# Altium schematic sheet GUI.SchDoc
size A
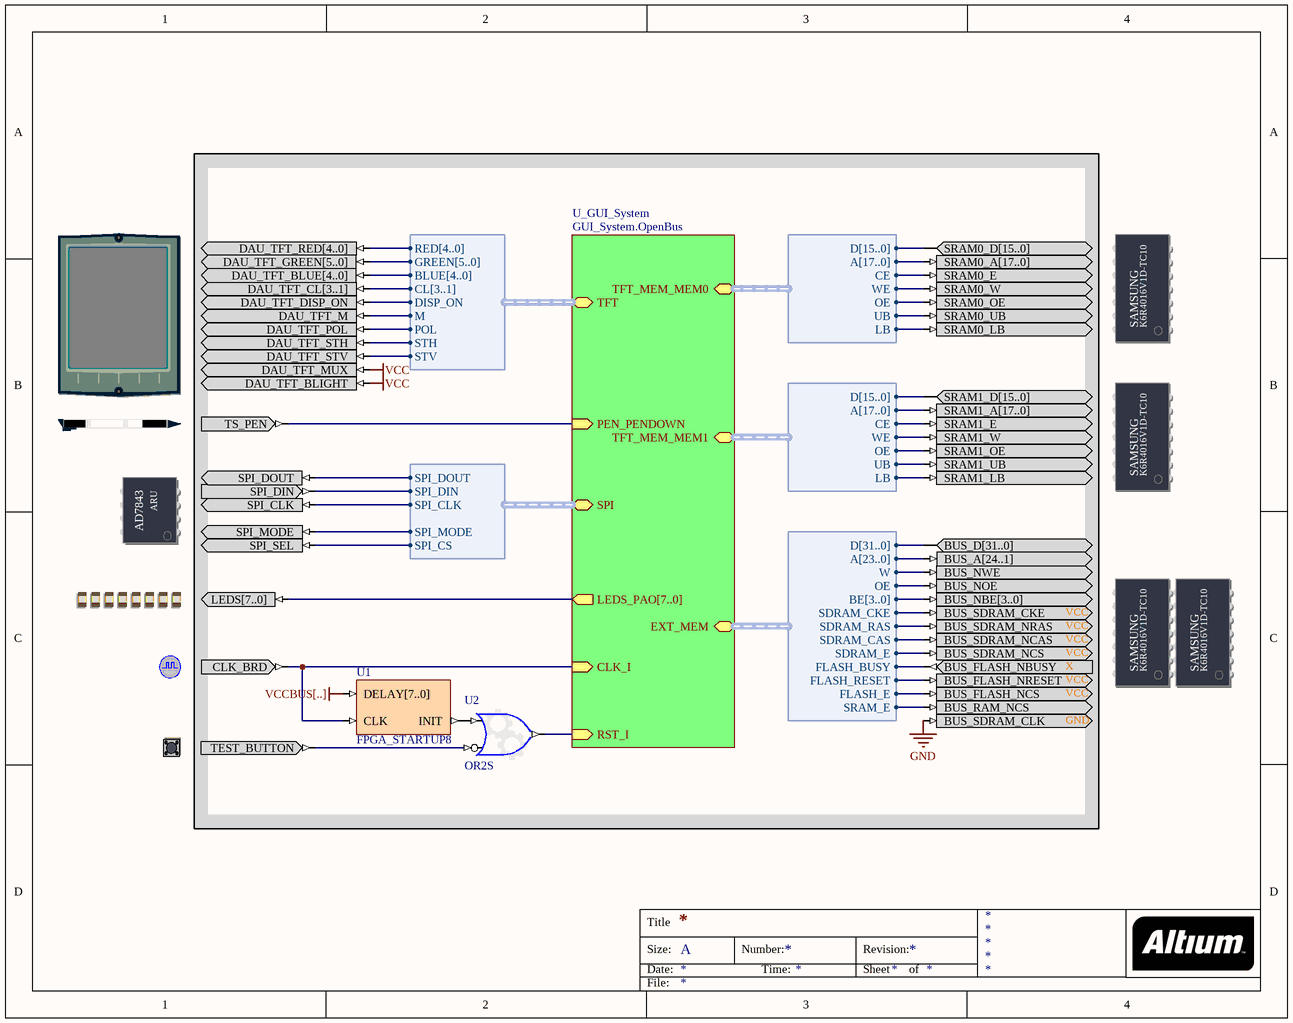
[diagram p0: GUI.SchDoc]

## Parts
(Parts that share a designator on the sheet are numbered #1, #2 ... from top to bottom, then left to right.)
?#1  TFT_LCD  (value not drawn)
?#2  SRAM_DAUGHTER0  (value not drawn)
?#3  SRAM_DAUGHTER1  (value not drawn)
?#4  TOUCHSCREEN_PEN_DOWN  (value not drawn)
?#5  TOUCH_SCREEN_DIGITIZER  (value not drawn)
?#6  SHARED_SRAM_DAUGHTER  (value not drawn)
?#7  LED  (value not drawn)
?#8  CLOCK_BOARD  (value not drawn)
?#9  TEST_BUTTON  (value not drawn)
U1  FPGA_STARTUP8
U2  OR2S

## Sub-sheets
U_GUI_System = GUI_System.OpenBus: RST_I (in), CLK_I (in), PEN_PENDOWN (in), LEDS_PAO[7..0] (out), SPI (harness SPI_W_NB), TFT_MEM_MEM0 (harness WB_MEM_CTRL_SRAM16_A18), TFT_MEM_MEM1 (harness WB_MEM_CTRL_SRAM16_A18), EXT_MEM (harness WB_SHARED_MEM_CTRL), TFT (harness VGA32_TFT)

## Harnesses
VGA32_TFT: RED[4..0], GREEN[5..0], BLUE[4..0], CL[3..1], DISP_ON, M, POL, STH, STV
SPI_W_NB: SPI_DOUT, SPI_DIN, SPI_CLK, SPI_MODE, SPI_CS
WB_MEM_CTRL_SRAM16_A18: D[15..0], A[17..0], CE, WE, OE, UB, LB
WB_SHARED_MEM_CTRL: D[31..0], A[23..0], W, OE, BE[3..0], SDRAM_CKE, SDRAM_RAS, SDRAM_CAS, SDRAM_E, FLASH_BUSY, FLASH_RESET, FLASH_E, SRAM_E

## Nets
GND: ?#6.BUS_SDRAM_CLK
VCC: ?#1.DAU_TFT_BLIGHT ?#1.DAU_TFT_MUX
VCCBUS[..]: U1.DELAY[7..0]
Net?#1_DAU_TFT_BLUE[4..0]: ?#1.DAU_TFT_BLUE[4..0] ; sheet U_GUI_System/TFT.BLUE[4..0]
Net?#1_DAU_TFT_CL[3..1]: ?#1.DAU_TFT_CL[3..1] ; sheet U_GUI_System/TFT.CL[3..1]
Net?#1_DAU_TFT_DISP_ON: ?#1.DAU_TFT_DISP_ON ; sheet U_GUI_System/TFT.DISP_ON
Net?#1_DAU_TFT_GREEN[5..0]: ?#1.DAU_TFT_GREEN[5..0] ; sheet U_GUI_System/TFT.GREEN[5..0]
Net?#1_DAU_TFT_M: ?#1.DAU_TFT_M ; sheet U_GUI_System/TFT.M
Net?#1_DAU_TFT_POL: ?#1.DAU_TFT_POL ; sheet U_GUI_System/TFT.POL
Net?#1_DAU_TFT_RED[4..0]: ?#1.DAU_TFT_RED[4..0] ; sheet U_GUI_System/TFT.RED[4..0]
Net?#1_DAU_TFT_STH: ?#1.DAU_TFT_STH ; sheet U_GUI_System/TFT.STH
Net?#1_DAU_TFT_STV: ?#1.DAU_TFT_STV ; sheet U_GUI_System/TFT.STV
Net?#2_SRAM0_A[17..0]: ?#2.SRAM0_A[17..0] ; sheet U_GUI_System/TFT_MEM_MEM0.A[17..0]
Net?#2_SRAM0_D[15..0]: ?#2.SRAM0_D[15..0] ; sheet U_GUI_System/TFT_MEM_MEM0.D[15..0]
Net?#2_SRAM0_E: ?#2.SRAM0_E ; sheet U_GUI_System/TFT_MEM_MEM0.CE
Net?#2_SRAM0_LB: ?#2.SRAM0_LB ; sheet U_GUI_System/TFT_MEM_MEM0.LB
Net?#2_SRAM0_OE: ?#2.SRAM0_OE ; sheet U_GUI_System/TFT_MEM_MEM0.OE
Net?#2_SRAM0_UB: ?#2.SRAM0_UB ; sheet U_GUI_System/TFT_MEM_MEM0.UB
Net?#2_SRAM0_W: ?#2.SRAM0_W ; sheet U_GUI_System/TFT_MEM_MEM0.WE
Net?#3_SRAM1_A[17..0]: ?#3.SRAM1_A[17..0] ; sheet U_GUI_System/TFT_MEM_MEM1.A[17..0]
Net?#3_SRAM1_D[15..0]: ?#3.SRAM1_D[15..0] ; sheet U_GUI_System/TFT_MEM_MEM1.D[15..0]
Net?#3_SRAM1_E: ?#3.SRAM1_E ; sheet U_GUI_System/TFT_MEM_MEM1.CE
Net?#3_SRAM1_LB: ?#3.SRAM1_LB ; sheet U_GUI_System/TFT_MEM_MEM1.LB
Net?#3_SRAM1_OE: ?#3.SRAM1_OE ; sheet U_GUI_System/TFT_MEM_MEM1.OE
Net?#3_SRAM1_UB: ?#3.SRAM1_UB ; sheet U_GUI_System/TFT_MEM_MEM1.UB
Net?#3_SRAM1_W: ?#3.SRAM1_W ; sheet U_GUI_System/TFT_MEM_MEM1.WE
Net?#4_TS_PEN: ?#4.TS_PEN ; sheet U_GUI_System/PEN_PENDOWN
Net?#5_SPI_CLK: ?#5.SPI_CLK ; sheet U_GUI_System/SPI.SPI_CLK
Net?#5_SPI_DIN: ?#5.SPI_DIN ; sheet U_GUI_System/SPI.SPI_DIN
Net?#5_SPI_DOUT: ?#5.SPI_DOUT ; sheet U_GUI_System/SPI.SPI_DOUT
Net?#5_SPI_MODE: ?#5.SPI_MODE ; sheet U_GUI_System/SPI.SPI_MODE
Net?#5_SPI_SEL: ?#5.SPI_SEL ; sheet U_GUI_System/SPI.SPI_CS
Net?#6_BUS_A[24..1]: ?#6.BUS_A[24..1] ; sheet U_GUI_System/EXT_MEM.A[23..0]
Net?#6_BUS_D[31..0]: ?#6.BUS_D[31..0] ; sheet U_GUI_System/EXT_MEM.D[31..0]
Net?#6_BUS_FLASH_NBUSY: ?#6.BUS_FLASH_NBUSY ; sheet U_GUI_System/EXT_MEM.FLASH_BUSY
Net?#6_BUS_FLASH_NCS: ?#6.BUS_FLASH_NCS ; sheet U_GUI_System/EXT_MEM.FLASH_E
Net?#6_BUS_FLASH_NRESET: ?#6.BUS_FLASH_NRESET ; sheet U_GUI_System/EXT_MEM.FLASH_RESET
Net?#6_BUS_NBE[3..0]: ?#6.BUS_NBE[3..0] ; sheet U_GUI_System/EXT_MEM.BE[3..0]
Net?#6_BUS_NOE: ?#6.BUS_NOE ; sheet U_GUI_System/EXT_MEM.OE
Net?#6_BUS_NWE: ?#6.BUS_NWE ; sheet U_GUI_System/EXT_MEM.W
Net?#6_BUS_RAM_NCS: ?#6.BUS_RAM_NCS ; sheet U_GUI_System/EXT_MEM.SRAM_E
Net?#6_BUS_SDRAM_CKE: ?#6.BUS_SDRAM_CKE ; sheet U_GUI_System/EXT_MEM.SDRAM_CKE
Net?#6_BUS_SDRAM_NCAS: ?#6.BUS_SDRAM_NCAS ; sheet U_GUI_System/EXT_MEM.SDRAM_CAS
Net?#6_BUS_SDRAM_NCS: ?#6.BUS_SDRAM_NCS ; sheet U_GUI_System/EXT_MEM.SDRAM_E
Net?#6_BUS_SDRAM_NRAS: ?#6.BUS_SDRAM_NRAS ; sheet U_GUI_System/EXT_MEM.SDRAM_RAS
Net?#7_LEDS[7..0]: ?#7.LEDS[7..0] ; sheet U_GUI_System/LEDS_PAO[7..0]
Net?#8_CLK_BRD: ?#8.CLK_BRD U1.CLK ; sheet U_GUI_System/CLK_I
Net?#9_TEST_BUTTON: ?#9.TEST_BUTTON U2.I1
NetU1_INIT: U1.INIT U2.I0
NetU2_O: U2.O ; sheet U_GUI_System/RST_I

## Notes on the sheet
- Title
- Size:
- Date:
- A
- Number:
- Time:
- Revision:
- Sheet
- of
- File:
- (in symbol SHARED_SRAM_DAUGHTER) VCC; X; SAMSUNG; K6R4016V1D-TC10; GND
- (in symbol SRAM_DAUGHTER0) SAMSUNG; K6R4016V1D-TC10
- (in symbol SRAM_DAUGHTER1) SAMSUNG; K6R4016V1D-TC10
- (in symbol TOUCH_SCREEN_DIGITIZER) ARU; AD7843

## Library data of the parts
?#1 = TFT_LCD: TFT LCD Panel; PortComponent: True; Published: 22-Jan-2007; Publisher: Altium Limited; HelpURL: TR0143 Technical Reference Manual for Altium's Desktop NanoBoard NB2DSK01.pdf#page=50
?#2 = SRAM_DAUGHTER0: Free Static RAM - Daughterboard; PortComponent: True; Published: 14-May-2007; Publisher: Altium Limited; HelpURL: TR0149 Technical Reference for Altium's Xilinx Spartan-3 Daughter Board DB30.pdf#page=16
?#3 = SRAM_DAUGHTER1: Free Static RAM - Daughterboard; PortComponent: True; Published: 14-May-2007; Publisher: Altium Limited; HelpURL: TR0149 Technical Reference for Altium's Xilinx Spartan-3 Daughter Board DB30.pdf#page=16
?#4 = TOUCH_SCREEN_PEN: TFT Touch Screen Pen; PortComponent: True; Published: 22-Jan-2007; Publisher: Altium Limited; HelpURL: TR0143 Technical Reference Manual for Altium's Desktop NanoBoard NB2DSK01.pdf#page=50
?#5 = TOUCH_SCREEN_DIGITIZER: Touch Screen Digitizer; PortComponent: True; Published: 22-Jan-2007; Publisher: Altium Limited; HelpURL: TR0143 Technical Reference Manual for Altium's Desktop NanoBoard NB2DSK01.pdf#page=50
?#6 = SHARED_SRAM_DAUGHTER: Common-Bus Static RAM - Daughterboard; PortComponent: True; Published: 14-May-2007; Publisher: Altium Limited; HelpURL: TR0149 Technical Reference for Altium's Xilinx Spartan-3 Daughter Board DB30.pdf#page=14
?#7 = LED: Bank of eight Red LEDs; PortComponent: True; Published: 19-Nov-2003; Publisher: Altium Limited; HelpURL: TR0143 Technical Reference Manual for Altium's Desktop NanoBoard NB2DSK01.pdf#page=51
?#8 = CLOCK_BOARD: Global System Clock Supply; PortComponent: True; Published: 19-Nov-2003; Publisher: Altium Limited; HelpURL: TR0143 Technical Reference Manual for Altium's Desktop NanoBoard NB2DSK01.pdf#page=41; UseInDSF: True
?#9 = TEST_BUTTON: Test / Reset Button; PortComponent: True; Published: 19-Nov-2003; Publisher: Altium Limited; HelpURL: TR0143 Technical Reference Manual for Altium's Desktop NanoBoard NB2DSK01.pdf#page=53
U1 = FPGA_STARTUP8: FPGA Startup With 8 Bit Delay; Published: 9-Dec-2004; Publisher: Altium Limited; HelpURL: CR0119 FPGA_STARTUPx Powerup Delay Unit.pdf; LastRevisionNo: 1.00.00; ComponentLink1Description: Core &Resource Usage; ComponentLink1URL: CR0139 FPGA Peripheral Resource Usage.pdf#page=11
U2 = GATE: Configurable Generic Gate; ConfiguratorName: GENERIC_GATE; ConfigurationParameters: {}Version[1.0]{}GateKind[OR]{}BusInput[False]{}GateInputType[Bit]{}GateOutputOption[Normal]{}BusWidth[8]{}RegisterOutputs[False]{}NegativeClockEdge[False]{}InputCount[2]{}InputInvert0[False]{}InputInvert1[True]{}; LastRevisionNo: 1.00.00; Published: 3-Sep-2008; Publisher: Altium Limited